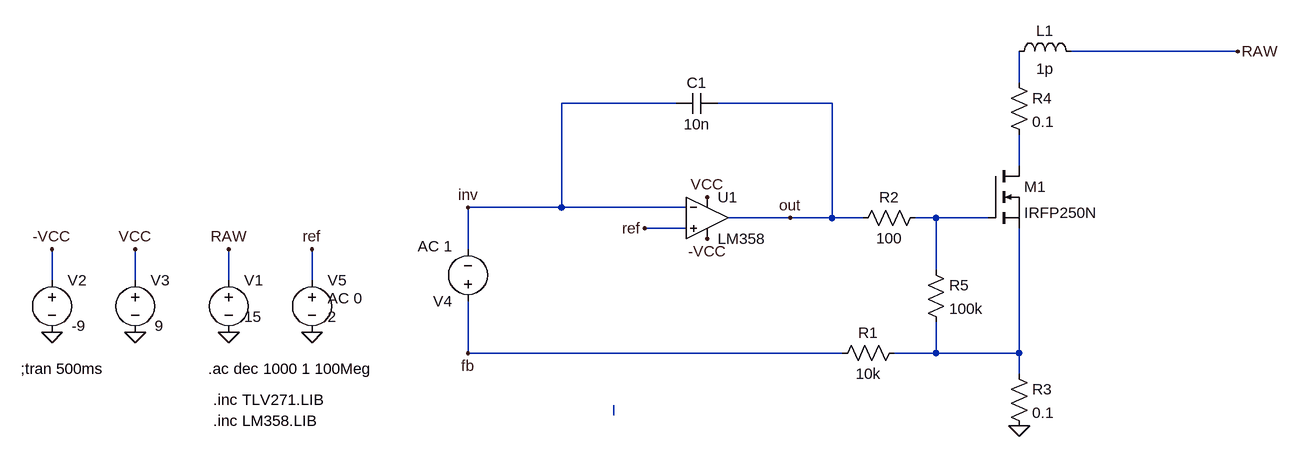
[diagram p0: schematic mosfet-stability-sample.asc]
mosfet-stability-sample.asc, the LTspice schematic file:
Version 4
SHEET 1 1508 680
WIRE 1024 -240 768 -240
WIRE 688 -192 688 -240
WIRE 160 -160 -16 -160
WIRE 400 -160 224 -160
WIRE 688 -64 688 -112
WIRE -16 0 -16 -160
WIRE -16 0 -160 0
WIRE 176 0 -16 0
WIRE 336 16 240 16
WIRE 400 16 400 -160
WIRE 400 16 336 16
WIRE 448 16 400 16
WIRE 560 16 528 16
WIRE 640 16 560 16
WIRE 176 32 112 32
WIRE -160 64 -160 0
WIRE 560 96 560 16
WIRE -800 112 -800 64
WIRE -672 112 -672 64
WIRE -528 112 -528 64
WIRE -400 112 -400 64
WIRE -160 224 -160 144
WIRE 416 224 -160 224
WIRE 560 224 560 176
WIRE 560 224 496 224
WIRE 688 224 688 32
WIRE 688 224 560 224
WIRE 688 256 688 224
WIRE 64 320 64 304
FLAG -528 192 0
FLAG -528 64 RAW
FLAG 208 -16 VCC
FLAG -672 192 0
FLAG -672 64 VCC
FLAG -160 224 fb
FLAG 688 336 0
FLAG 1024 -240 RAW
FLAG 336 16 out
FLAG -800 192 0
FLAG -800 64 -VCC
FLAG 208 48 -VCC
FLAG -400 192 0
FLAG -400 64 ref
FLAG 112 32 ref
FLAG -160 0 inv
SYMBOL voltage -528 96 R0
WINDOW 123 24 44 Left 2
WINDOW 39 0 0 Left 0
WINDOW 3 24 72 Left 2
SYMATTR Value 15
SYMATTR InstName V1
SYMBOL voltage -672 96 R0
WINDOW 123 24 44 Left 2
WINDOW 39 0 0 Left 0
WINDOW 3 30 86 Left 2
SYMATTR Value 9
SYMATTR InstName V3
SYMBOL voltage -160 160 R180
WINDOW 123 24 100 Left 2
WINDOW 39 0 0 Left 0
WINDOW 3 24 128 Left 2
SYMATTR Value2 AC 1
SYMATTR Value ""
SYMATTR InstName V4
SYMBOL nmos 640 -64 R0
SYMATTR InstName M1
SYMATTR Value IRFP250N
SYMBOL res 672 240 R0
SYMATTR InstName R3
SYMATTR Value 0.1
SYMBOL res 672 -208 R0
SYMATTR InstName R4
SYMATTR Value 0.1
SYMBOL voltage -800 96 R0
WINDOW 123 24 44 Left 2
WINDOW 39 0 0 Left 0
WINDOW 3 30 86 Left 2
SYMATTR Value -9
SYMATTR InstName V2
SYMBOL voltage -400 96 R0
WINDOW 123 24 44 Left 2
WINDOW 39 0 0 Left 0
WINDOW 3 24 72 Left 2
SYMATTR Value2 AC 0
SYMATTR Value 2
SYMATTR InstName V5
SYMBOL ind 672 -224 R270
WINDOW 0 32 56 VTop 2
WINDOW 3 5 56 VBottom 2
SYMATTR InstName L1
SYMATTR Value 1p
SYMBOL OpAmps\\opamp2 208 -48 R0
SYMATTR InstName U1
SYMATTR Value LM358
SYMBOL res 512 208 R90
WINDOW 0 0 56 VBottom 2
WINDOW 3 32 56 VTop 2
SYMATTR InstName R1
SYMATTR Value 10k
SYMBOL res 544 0 R90
WINDOW 0 0 56 VBottom 2
WINDOW 3 32 56 VTop 2
SYMATTR InstName R2
SYMATTR Value 100
SYMBOL cap 224 -176 R90
WINDOW 0 0 32 VBottom 2
WINDOW 3 32 32 VTop 2
SYMATTR InstName C1
SYMATTR Value 10n
SYMBOL res 544 80 R0
SYMATTR InstName R5
SYMATTR Value 100k
TEXT -560 248 Left 2 !.ac dec 1000 1 100Meg
TEXT -552 296 Left 2 !.inc TLV271.LIB
TEXT -552 328 Left 2 !.inc LM358.LIB
TEXT -848 248 Left 2 !;tran 500ms

The netlist it stands for:
* mosfet-stability-sample.asc
V1 RAW 0 15
V3 VCC 0 9
V4 fb inv AC 1
M1 N002 N003 N004 N004 IRFP250N
R3 N004 0 0.1
R4 N001 N002 0.1
V2 -VCC 0 -9
V5 ref 0 2 AC 0
L1 N001 RAW 1p
XU1 ref inv VCC -VCC out LM358  ; pins In+ In- V+ V- OUT
R1 N004 fb 10k
R2 N003 out 100
C1 out inv 10n
R5 N003 N004 100k
.model NMOS NMOS
.model PMOS PMOS
.lib standard.mos
.ac dec 1000 1 100Meg
.inc TLV271.LIB
.inc LM358.LIB
;tran 500ms
.backanno
.end